# Altium schematic sheet Decoup_Cap 2.SchDoc
size A
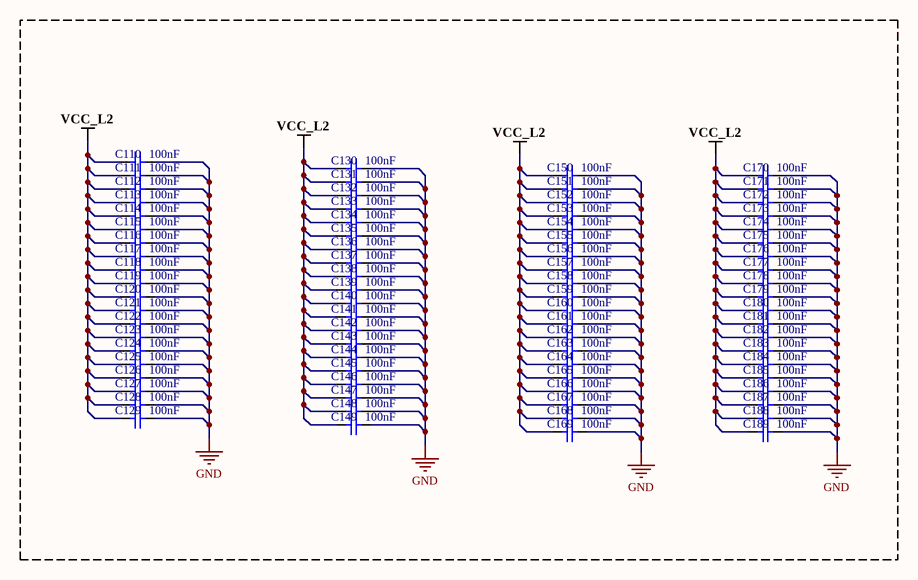
[diagram p0: Decoup_Cap 2.SchDoc]

## Parts
C110  100nF  [Cap0402]
C111  100nF  [Cap0402]
C112  100nF  [Cap0402]
C113  100nF  [Cap0402]
C114  100nF  [Cap0402]
C115  100nF  [Cap0402]
C116  100nF  [Cap0402]
C117  100nF  [Cap0402]
C118  100nF  [Cap0402]
C119  100nF  [Cap0402]
C120  100nF  [Cap0402]
C121  100nF  [Cap0402]
C122  100nF  [Cap0402]
C123  100nF  [Cap0402]
C124  100nF  [Cap0402]
C125  100nF  [Cap0402]
C126  100nF  [Cap0402]
C127  100nF  [Cap0402]
C128  100nF  [Cap0402]
C129  100nF  [Cap0402]
C130  100nF  [Cap0402]
C131  100nF  [Cap0402]
C132  100nF  [Cap0402]
C133  100nF  [Cap0402]
C134  100nF  [Cap0402]
C135  100nF  [Cap0402]
C136  100nF  [Cap0402]
C137  100nF  [Cap0402]
C138  100nF  [Cap0402]
C139  100nF  [Cap0402]
C140  100nF  [Cap0402]
C141  100nF  [Cap0402]
C142  100nF  [Cap0402]
C143  100nF  [Cap0402]
C144  100nF  [Cap0402]
C145  100nF  [Cap0402]
C146  100nF  [Cap0402]
C147  100nF  [Cap0402]
C148  100nF  [Cap0402]
C149  100nF  [Cap0402]
C150  100nF  [Cap0402]
C151  100nF  [Cap0402]
C152  100nF  [Cap0402]
C153  100nF  [Cap0402]
C154  100nF  [Cap0402]
C155  100nF  [Cap0402]
C156  100nF  [Cap0402]
C157  100nF  [Cap0402]
C158  100nF  [Cap0402]
C159  100nF  [Cap0402]
C160  100nF  [Cap0402]
C161  100nF  [Cap0402]
C162  100nF  [Cap0402]
C163  100nF  [Cap0402]
C164  100nF  [Cap0402]
C165  100nF  [Cap0402]
C166  100nF  [Cap0402]
C167  100nF  [Cap0402]
C168  100nF  [Cap0402]
C169  100nF  [Cap0402]
C170  100nF  [Cap0402]
C171  100nF  [Cap0402]
C172  100nF  [Cap0402]
C173  100nF  [Cap0402]
C174  100nF  [Cap0402]
C175  100nF  [Cap0402]
C176  100nF  [Cap0402]
C177  100nF  [Cap0402]
C178  100nF  [Cap0402]
C179  100nF  [Cap0402]
C180  100nF  [Cap0402]
C181  100nF  [Cap0402]
C182  100nF  [Cap0402]
C183  100nF  [Cap0402]
C184  100nF  [Cap0402]
C185  100nF  [Cap0402]
C186  100nF  [Cap0402]
C187  100nF  [Cap0402]
C188  100nF  [Cap0402]
C189  100nF  [Cap0402]

## Nets
GND: C110.1 C111.1 C112.1 C113.1 C114.1 C115.1 C116.1 C117.1 C118.1 C119.1 C120.1 C121.1 C122.1 C123.1 C124.1 C125.1 C126.1 C127.1 C128.1 C129.1 C130.1 C131.1 C132.1 C133.1 C134.1 C135.1 C136.1 C137.1 C138.1 C139.1 C140.1 C141.1 C142.1 C143.1 C144.1 C145.1 C146.1 C147.1 C148.1 C149.1 C150.1 C151.1 C152.1 C153.1 C154.1 C155.1 C156.1 C157.1 C158.1 C159.1 C160.1 C161.1 C162.1 C163.1 C164.1 C165.1 C166.1 C167.1 C168.1 C169.1 C170.1 C171.1 C172.1 C173.1 C174.1 C175.1 C176.1 C177.1 C178.1 C179.1 C180.1 C181.1 C182.1 C183.1 C184.1 C185.1 C186.1 C187.1 C188.1 C189.1
VCC_L2: C110.2 C111.2 C112.2 C113.2 C114.2 C115.2 C116.2 C117.2 C118.2 C119.2 C120.2 C121.2 C122.2 C123.2 C124.2 C125.2 C126.2 C127.2 C128.2 C129.2 C130.2 C131.2 C132.2 C133.2 C134.2 C135.2 C136.2 C137.2 C138.2 C139.2 C140.2 C141.2 C142.2 C143.2 C144.2 C145.2 C146.2 C147.2 C148.2 C149.2 C150.2 C151.2 C152.2 C153.2 C154.2 C155.2 C156.2 C157.2 C158.2 C159.2 C160.2 C161.2 C162.2 C163.2 C164.2 C165.2 C166.2 C167.2 C168.2 C169.2 C170.2 C171.2 C172.2 C173.2 C174.2 C175.2 C176.2 C177.2 C178.2 C179.2 C180.2 C181.2 C182.2 C183.2 C184.2 C185.2 C186.2 C187.2 C188.2 C189.2

## Library data of the parts
C110-C189 = CC0402KRX7R8BB104: CAP CER 0.1UF 25V X7R 0402; Manufacturer: Yageo; Tolerance: 10%; Dissipation Factor: 3.5%; Supplier 1: Digi-Key; Manufacturer Part Number: CC0402KRX7R8BB104; RoHS: Yes; Category: Ceramic Capacitors; Stock 1: 1841009; Pricing 1: 1=0.10000, 10=0.03100, 50=0.01700, 100=0.01390, 500=0.00990, 1000=0.00777, 2500=0.00707, 5000=0.00650 (USD); Mount: Surface Mount; Case/Package: 0402; Case Code (Imperial): 0402; Case Code (Metric): 1005; Min Operating Temperature: -55°C; Max Operating Temperature: 125°C; Capacitance: 100nF; Dielectric: X7R; Voltage Rating: 25V; Voltage Rating (DC): 25V; Packaging: Tape and Reel; Termination: SMD/SMT; Resistor Type: Ceramic; Length: 1mm; Width: 0.02inch; Height: 0.5mm; Thickness: 0.022inch; Depth: 0.5mm; Radiation Hardening: No; Lead Free: Lead Free; Halogen Free: Halogen Free; ComponentLink1URL: https://datasheet.ciiva.com/11464/upy-gphc-x7r-6-3v-to-50v-8-11464889.pdf?src-supplier=Avnet; ComponentLink1Description: https://datasheet.ciiva.com/11464/upy-gphc-x7r-6-3v-to-50v-8-11464889.pdf?src-supplier=Avnet; ComponentLink2URL: https://datasheet.ciiva.com/13210/upy-gphc-x7r-6-3v-to-50v-8-12304-13210908.pdf?src-supplier=Mouser; ComponentLink2Description: https://datasheet.ciiva.com/13210/upy-gphc-x7r-6-3v-to-50v-8-12304-13210908.pdf?src-supplier=Mouser; ComponentLink3URL: https://datasheet.ciiva.com/17437/upy-gphc-x7r-6-3v-to-50v-8-17437357.pdf?src-supplier=Avnet+Europe; ComponentLink3Description: https://datasheet.ciiva.com/17437/upy-gphc-x7r-6-3v-to-50v-8-17437357.pdf?src-supplier=Avnet+Europe; Supplier Part Number 1: 311-2077-1-ND